# EAGLE design tiny84xbee-humi_dualProbe_v2e (EAGLE 5.10)
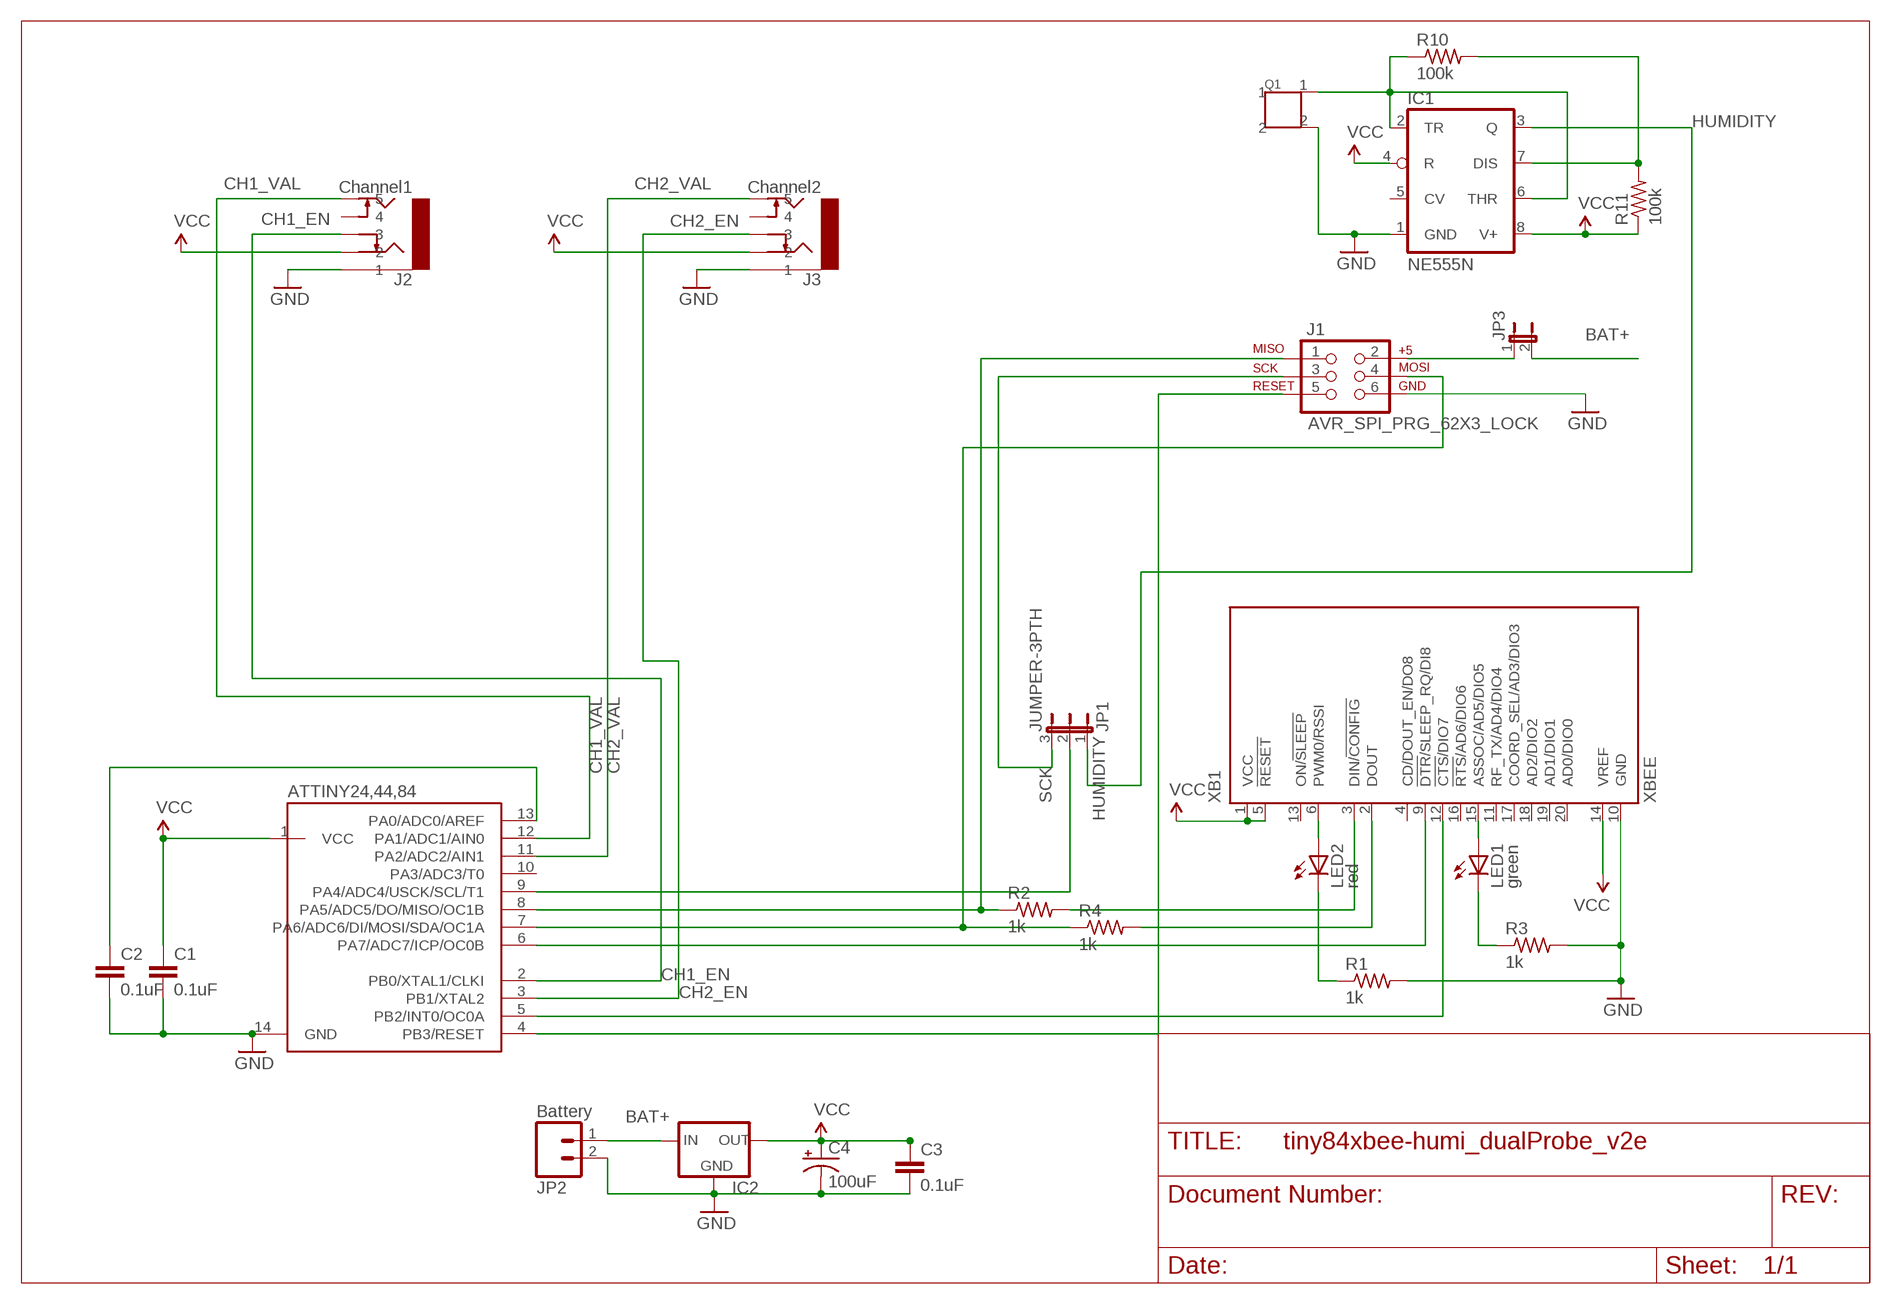
[diagram p0: schematic, sheet 1]

## Parts
ATTINY24,44,84  ATTINY24PDIP  [DIL14]
C1  0.1uF  C-EU050-025X075  [C050-025X075]
C2  0.1uF  C-EU050-035X075  [C050-035X075]
C3  0.1uF  C-EU050-035X075  [C050-035X075]
C4  100uF  CPOL-USE2-5  [E2-5]
IC1  NE555N  [DIL08-ROUND]
IC2  MCP1700INLINE  [TO92-INLINE]
J1  AVR_SPI_PRG_62X3_LOCK  [2X3_LOCK]
J2  Channel1  AUDIO-JACK-5PKYCON-STX-315X-5-X  [KYCON-STX-315X-5-XX]
J3  Channel2  AUDIO-JACK-5PKYCON-STX-315X-5-X  [KYCON-STX-315X-5-XX]
JP1  JUMPER-3PTH  [1X03]
JP2  Battery  M025MM  [SCREWTERMINAL-5MM-2]
JP3  JUMPER-2PTH  [1X02]
LED1  green  LED3MM  [LED3MM]
LED2  red  LED3MM  [LED3MM]
Q1  HCH1000  [HCH1000-001]
R1  1k  R-US_0207/10  [0207/10]
R2  1k  R-US_0207/10  [0207/10]
R3  1k  R-US_0207/10  [0207/10]
R4  1k  R-US_0207/10  [0207/10]
R10  100k  R-US_0207/10  [0207/10]
R11  100k  R-US_0207/10  [0207/10]
XB1  XBEE  [XBEE]

## Nets
BAT+: IC2.2(IN) JP2.1 JP3.2
CH1_EN: ATTINY24,44,84.2(PB0/XTAL1/CLKI) J2.P$5
CH1_VAL: ATTINY24,44,84.12(PA1/ADC1/AIN0) J2.P$4
CH2_EN: ATTINY24,44,84.3(PB1/XTAL2) J3.P$5
CH2_VAL: ATTINY24,44,84.11(PA2/ADC2/AIN1) J3.P$4
GND: ATTINY24,44,84.14(GND) C1.2 C2.2 C3.2 C4.- IC1.1(GND) IC2.1(GND) J1.6 J2.P$1 J3.P$1 JP2.2 Q1.2 R1.2 R3.2 XB1.10(GND)
HUMIDITY: IC1.3(Q) JP1.1
ICP5V: J1.2 JP3.1
MISO: ATTINY24,44,84.8(PA5/ADC5/DO/MISO/OC1B) J1.1 R2.1
MOSI: ATTINY24,44,84.7(PA6/ADC6/DI/MOSI/SDA/OC1A) J1.4 R4.1
N$1: IC1.2(TR) IC1.6(THR) Q1.1 R10.1
N$2: LED1.A XB1.15(ASSOC/AD5/DIO5)
N$3: LED1.K(C) R3.1
N$4: IC1.7(DIS) R10.2 R11.2
N$5: ATTINY24,44,84.13(PA0/ADC0/AREF) C2.1
N$6: R2.2 XB1.3(DIN/!CONFIG)
N$7: R4.2 XB1.2(DOUT)
N$8: LED2.K(C) R1.1
N$9: LED2.A XB1.6(PWM0/RSSI)
N$10: ATTINY24,44,84.5(PB2/INT0/OC0A) XB1.12(!CTS!/DIO7)
RESET: ATTINY24,44,84.4(PB3/RESET) J1.5
SCK: J1.3 JP1.3
SHARED: ATTINY24,44,84.9(PA4/ADC4/USCK/SCL/T1) JP1.2
SLEEP: ATTINY24,44,84.6(PA7/ADC7/ICP/OC0B) XB1.9(!DTR!/SLEEP_RQ/DI8)
VCC: ATTINY24,44,84.1(VCC) C1.1 C3.1 C4.+ IC1.4(R) IC1.8(V+) IC2.3(OUT) J2.P$2 J3.P$2 R11.1 XB1.1(VCC) XB1.5(!RESET) XB1.14(VREF)
Unconnected: ATTINY24,44,84.10(PA3/ADC3/T0) IC1.5(CV) J2.P$3 J3.P$3 XB1.4(CD/DOUT_EN/DO8) XB1.11(RF_TX/AD4/DIO4) XB1.13(ON/!SLEEP) XB1.16(!RTS!/AD6/DIO6) XB1.17(COORD_SEL/AD3/DIO3) XB1.18(AD2/DIO2) XB1.19(AD1/DIO1) XB1.20(AD0/DIO0)

## Library data of the parts
ATTINY24,44,84 = karlnet-parts:ATTINY24: ATtiny24/44/84. pdip and qfn packages, but the QFN package does _not_ have the bottom pad connected to ground. (doing so would make a 15 pad package, and you couldn't have PDIP and QFN in the same part)
C1-C3 = resistor:C-EU: CAPACITOR, European symbol
C4 = resistor:CPOL-US: POLARIZED CAPACITOR, American symbol
IC1 = adafruit:*555: TIMER Changed DIP package to have round (not oval) pin pads http://www.ladyada.net/library/pcb/eaglelibrary.html
IC2 = karlnet-parts:MCP1700: VOLTAGE REGULATOR
J1 = karlnet-parts:AVR_SPI_PRG_6: AVR ISP 6 Pin This is the reduced ISP connector for AVR programming. Common on Arduino. This footprint will take up less PCB space and can be used with a 10-pin to 6-pin adapter such as SKU: BOB-08508
J2 J3 = karlnet-parts:AUDIO-JACK-5P: Stereo Audio Jack, with switches for each signal contact
JP1 = SparkFun:JUMPER-3
JP2 = SparkFun:M02: Header 2 Standard 2-pin 0.1" header. Use with straight break away headers (SKU : PRT-00116), right angle break away headers (PRT-00553), swiss pins (PRT-00743), machine pins (PRT-00117), and female headers (PRT-00115). Molex polarized connector foot print use with SKU : PRT-08233 with associated crimp pins and housings.
JP3 = SparkFun:JUMPER-2: Jumper Basic 0.1" spaced jumper. Use with breakaway headers.
LED1 LED2 = adafruit:LED: LED OSRAM: - CHIPLED LG R971, LG N971, LY N971, LG Q971, LY Q971, LO R971, LY R971 LH N974, LH R974 LS Q976, LO Q976, LY Q976 LO Q996 - Hyper CHIPLED LW Q18S LB Q993, LB Q99A, LB R99A - SideLED LS A670, LO A670, LY A670, LG A670, LP A670 LB A673, LV A673, LT A673, LW A673 LH A674 LY A675 LS A676, LA A676, LO A676, LY A676, LW A676 LS A679, LY A679, LG A679 - Hyper Micro SIDELED® LS Y876, LA Y876, LO Y876, LY Y876 LT Y87S - SmartLED LW L88C, LW L88S LB L89C, LB L89S, LG L890 LS L89K, LO L89K, LY L89K LS L896, LA L896, LO L896, LY L896 - TOPLED LS T670, LO T670, LY T670, LG T670, LP T670 LSG T670, LSP T670, LSY T670, LOP T670, LYG T670 LG T671, LOG T671, LSG T671 LB T673, LV T673, LT T673, LW T673 LH T674 LS T676, LA T676, LO T676, LY T676, LB T676, LH T676, LSB T676, LW T676 LB T67C, LV T67C, LT T67C, LS T67K, LO T67K, LY T67K, LW E67C LS E67B, LA E67B, LO E67B, LY E67B, LB E67C, LV E67C, LT E67C LW T67C LS T679, LY T679, LG T679 LS T770, LO T770, LY T770, LG T770, LP T770 LB T773, LV T773, LT T773, LW T773 LH T774 LS E675, LA E675, LY E675, LS T675 LS T776, LA T776, LO T776, LY T776, LB T776 LHGB T686 LT T68C, LB T68C - Hyper Mini TOPLED® LB M676 - Mini TOPLED Santana® LG M470 LS M47K, LO M47K, LY M47K Source: http://www.osram.convergy.de/
Q1 = karlnet-parts:HCH1000: HCH1000 Capacitive Humidity Sensor Honeywell, cheap, capacitance varies with humidity
R1-R4 R10 R11 = resistor:R-US_: RESISTOR, American symbol
XB1 = microbuilder:XBEE: XBee (TM) /XBee-PRO(TM) OEM RF Modules Source: MaxStream, Inc. xbee_productmanual.pdf

## Board
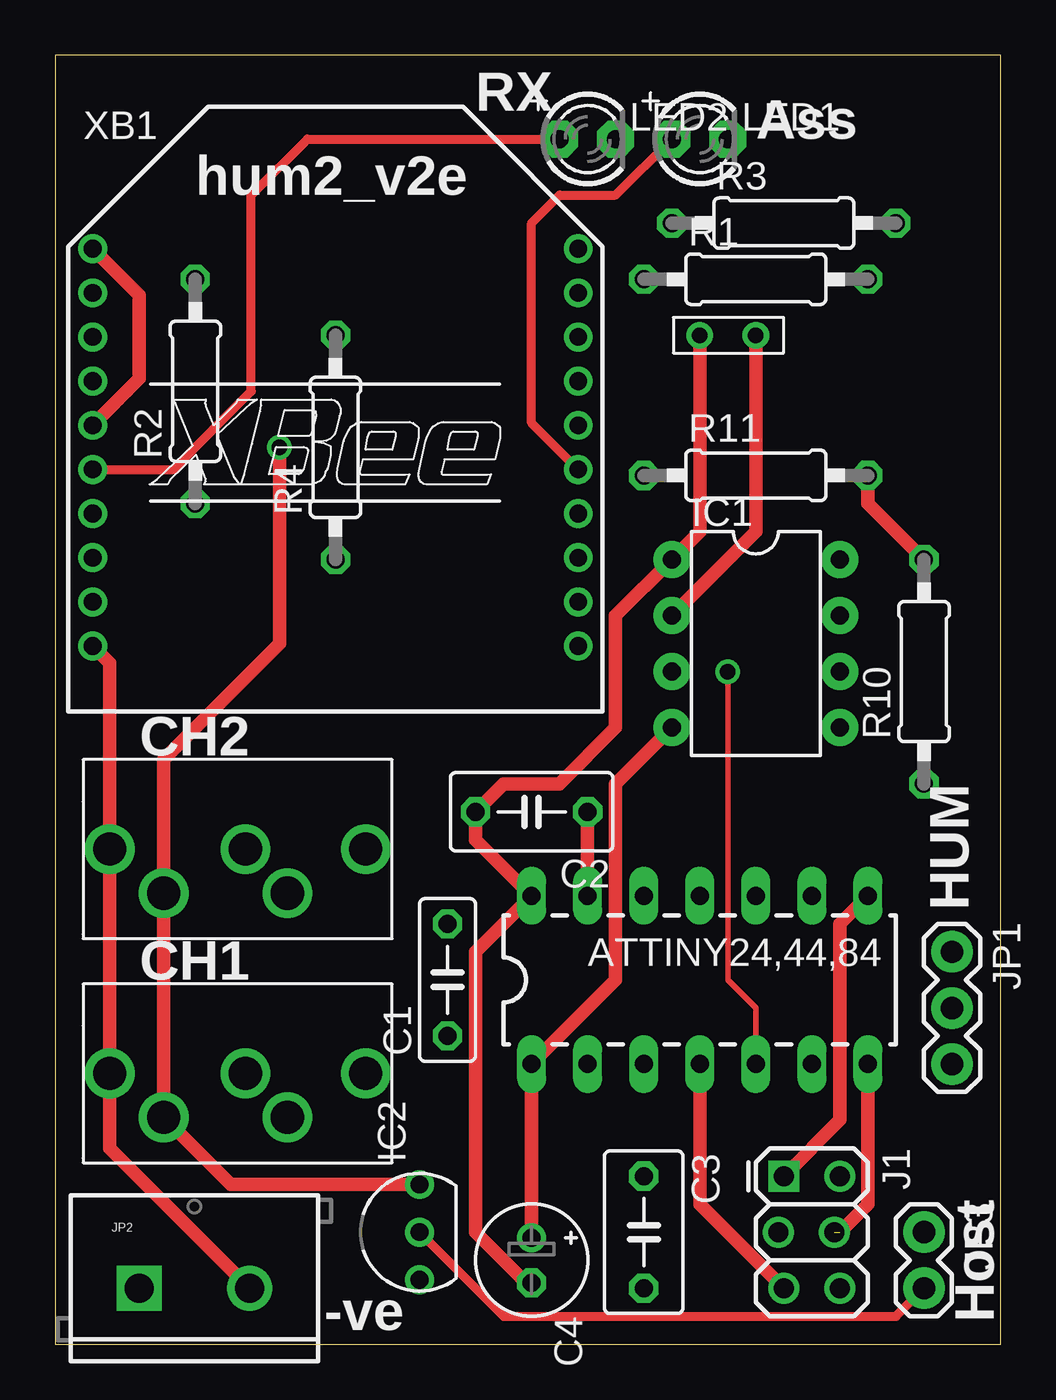
[diagram p1: board, top side]
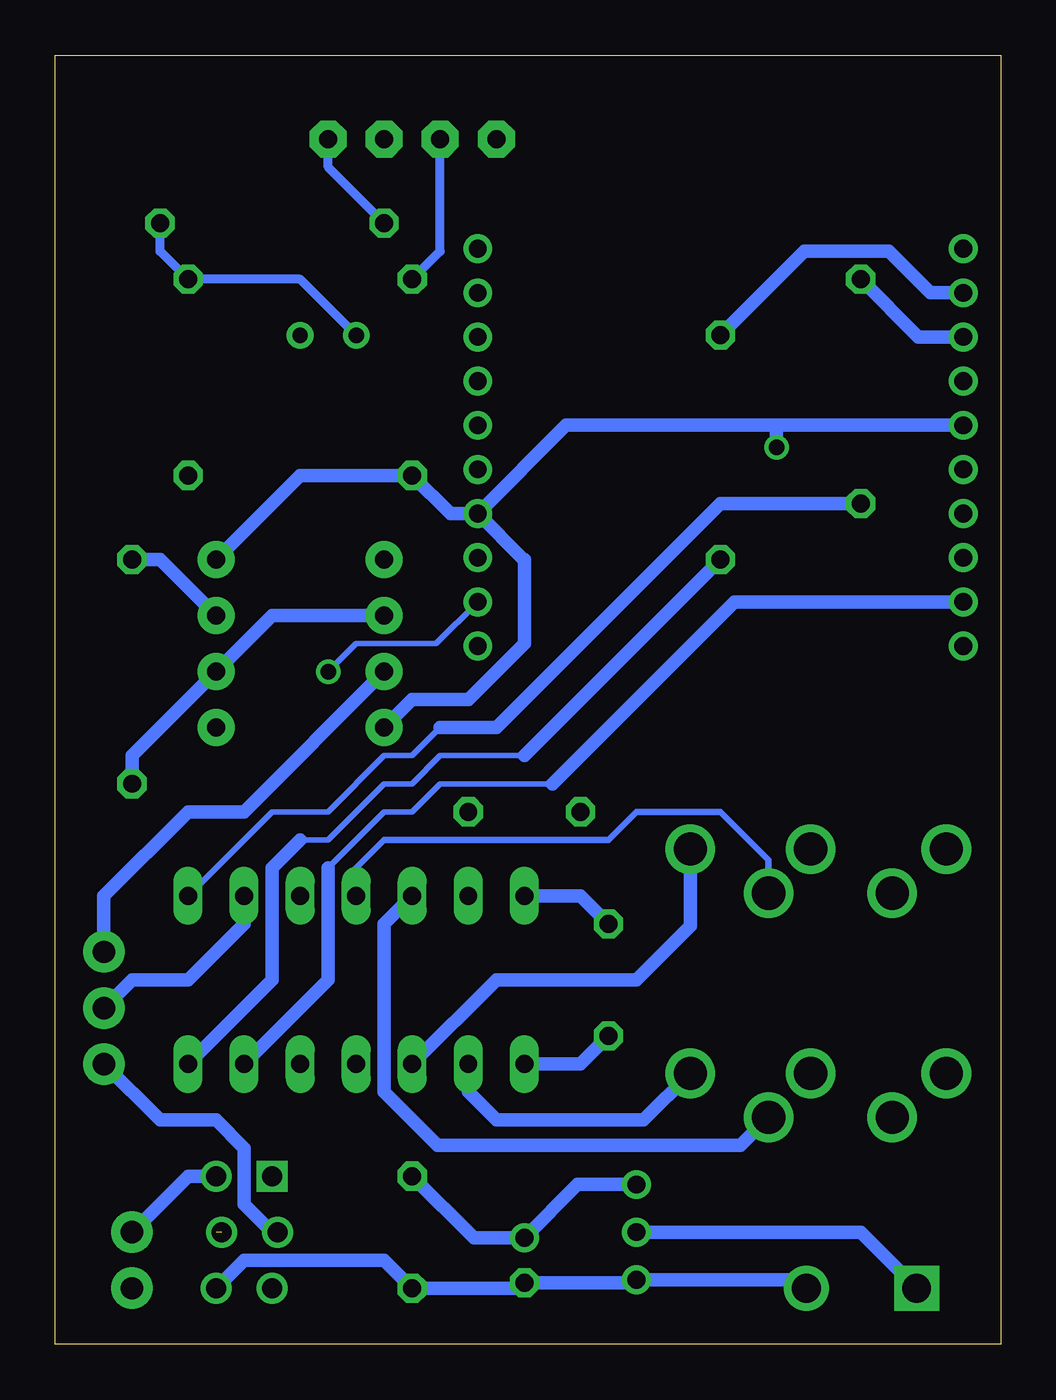
[diagram p2: board, bottom side, seen from below]

Size 42.85 x 58.41 mm. Coordinates in mm from the lower left corner, seen from the top.
Outline: 0,0 42.85,0 42.85,58.41 0,58.41 0,0
Copper layers (1*16): Top 0.035mm / dielectric 1.5mm / Bottom 0.035mm
Design rules "olimex-10mils": minimum track width 10mil, minimum drill 24mil, track to track 10mil, track to pad 10mil, pad to pad 10mil, via to via 10mil, smd to smd 10mil, copper to edge 40mil, drill to drill 10mil, minimum pad ring 10mil, minimum via ring 8mil, stop-mask expansion 0mil, vias tented up to drill 0mil, thermal gap 10mil

### Footprints (pad centres in the part's own frame; a part is rotated, then mirrored left to right if it is on the bottom)
DIL14 = drill 0.813 long: 1 -8.89,-3.81; 2 -6.35,-3.81; 3 -3.81,-3.81; 4 -1.27,-3.81; 5 1.27,-3.81; 6 3.81,-3.81; 7 6.35,-3.81; 8 6.35,3.81; 9 3.81,3.81; 10 1.27,3.81; 11 -1.27,3.81; 12 -3.81,3.81; 13 -6.35,3.81; 14 -8.89,3.81
C050-025X075 = drill 0.813 octagon: 1 -2.54,0; 2 2.54,0
C050-035X075 = drill 0.813 octagon: 1 -2.54,0; 2 2.54,0
E2-5 = drill 0.813 pad 1.27 round: + -1.016,0 | drill 0.813 pad 1.27 octagon: - 1.016,0
DIL08-ROUND = drill 0.813 pad 1.676 round: 1 -3.81,-3.81; 2 -1.27,-3.81; 3 1.27,-3.81; 4 3.81,-3.81; 5 3.81,3.81; 6 1.27,3.81; 7 -1.27,3.81; 8 -3.81,3.81
TO92-INLINE = drill 0.8 round: 1 -2.159,0; 2 0,0; 3 2.159,0
2X3_LOCK = drill 0.9 square: 1 0,0 | drill 0.9 round: 2 0,2.54; 3 2.54,-0.254; 4 2.54,2.286; 5 5.08,0; 6 5.08,2.54
KYCON-STX-315X-5-XX = drill 1.5 round: P$1 1.2,0.85; P$2 3.65,-1.15; P$3 7.35,0.85; P$4 9.25,-1.15; P$5 12.8,0.85
1X03 = drill 1.016 pad 1.88 round: 1 0,0; 2 2.54,0; 3 5.08,0
SCREWTERMINAL-5MM-2 = drill 1.3 pad 2.032 square: 1 0,0 | drill 1.3 pad 2.032 round: 2 5,0
1X02 = drill 1.016 pad 1.88 round: 1 0,0; 2 2.54,0
LED3MM = drill 0.813 pad 1.676 octagon: A -1.27,0; K 1.27,0
HCH1000-001 = drill 0.7 round: 1 -2.54,0; 2 0,0
0207/10 = drill 0.813 octagon: 1 -5.08,0; 2 5.08,0
XBEE = drill 0.8 pad 1.27 round: 1 -11,9; 2 -11,7; 3 -11,5; 4 -11,3; 5 -11,1; 6 -11,-1; 7 -11,-3; 8 -11,-5; 9 -11,-7; 10 -11,-9; 11 11,-9; 12 11,-7; 13 11,-5; 14 11,-3; 15 11,-1; 16 11,1; 17 11,3; 18 11,5; 19 11,7; 20 11,9

### Placement (x,y rotation side)
ATTINY24,44,84  30.48,16.51 0 top
C1  17.78,16.51 90 top
C2  21.59,24.13 180 top
C3  26.67,5.08 270 top
C4  21.59,3.81 270 top
IC1  31.75,31.75 270 top
IC2  16.51,5.08 90 top
J1  33.02,7.62 270 top
J2  1.27,11.43 0 top
J3  1.27,21.59 0 top
JP1  40.64,17.78 270 top
JP2  3.81,2.54 0 top
JP3  39.37,5.08 270 top
LED1  29.21,54.61 0 top
LED2  24.13,54.61 0 top
Q1  29.21,45.72 180 top
R1  31.75,48.26 0 top
R2  6.35,43.18 90 top
R3  33.02,50.8 0 top
R4  12.7,40.64 90 top
R10  39.37,30.48 90 top
R11  31.75,39.37 0 top
XB1  12.7,40.64 0 top

### Tracks (layer width: path | path; a pad name or v marks a point on that pad's centre or on a via)
BAT+
  Top 0.406: IC2.2 20.32,1.27 38.1,1.27 JP3.2
  Bottom 0.61: JP2.1 6.35,5.08 IC2.2
CH1_EN
  Bottom 0.61: ATTINY24,44,84.2 24.13,11.43 22.86,10.16 16.19,10.16 J2.P$5
CH1_VAL
  Bottom 0.61: ATTINY24,44,84.12 27.94,19.05 27.94,11.43 25.52,9.01 11.79,9.01 J2.P$4
CH2_EN
  Bottom 0.61: ATTINY24,44,84.3 22.86,16.51 16.51,16.51 14.07,18.95 J3.P$5
CH2_VAL
  Bottom 0.305: ATTINY24,44,84.11 29.21,21.59 27.94,22.86 17.78,22.86 16.51,24.13 12.7,24.13 10.52,21.95 J3.P$4
GND
  Top 0.61: JP2.2 2.47,8.88 J2.P$1 J3.P$1 2.47,30.87 XB1.10 | C4.- 21.34,2.79 19.05,5.08 19.05,17.78 ATTINY24,44,84.14 19.05,22.86 C2.2 20.32,25.4 22.86,25.4 25.4,27.94 25.4,33.02 IC1.1 29.21,36.83 Q1.2
  Bottom 0.406: R3.2 38.1,49.53 R1.2 31.75,48.26 Q1.2
  Bottom 0.61: JP2.2 9.19,2.92 IC2.1 16.64,2.79 C4.- 21.84,2.54 C3.2 27.94,3.81 34.29,3.81 J1.6 | C1.2 19.05,20.32 ATTINY24,44,84.14
HUMIDITY
  Bottom 0.61: IC1.3 34.29,24.13 36.83,24.13 40.64,20.32 JP1.1
ICP5V
  Bottom 0.61: J1.2 36.83,7.62 JP3.1
MISO
  Top 0.61: ATTINY24,44,84.8 35.56,19.05 35.56,10.16 J1.1
  Bottom 0.254: ATTINY24,44,84.8 33.02,24.13 30.48,24.13 27.94,26.67 26.67,26.67 25.4,27.94
  Bottom 0.61: 25.4,27.94 22.86,27.94 12.7,38.1 R2.1
MOSI  (1 unrouted)
  Top 0.61: ATTINY24,44,84.7 36.83,6.35 35.56,5.08
  Bottom 0.254: 31.75,22.86 30.48,22.86 27.94,25.4 26.67,25.4 25.4,26.67 21.59,26.67
  Bottom 0.61: ATTINY24,44,84.7 33.02,16.51 33.02,21.59 31.75,22.86 | 21.59,26.67 R4.1
N$1
  Top 0.61: Q1.1 31.75,36.83 IC1.2
  Bottom 0.61: R10.1 39.37,26.67 IC1.6 33.02,33.02 IC1.2
N$2
  Top 0.406: LED1.A 25.4,52.07 22.86,52.07 21.59,50.8 21.59,41.75 XB1.15
N$3
  Bottom 0.406: LED1.K 30.48,53.34 R3.1
N$4
  Top 0.61: R11.2 36.83,38.1 R10.2
  Bottom 0.61: IC1.7 38.1,35.56 R10.2
N$5
  Top 0.61: ATTINY24,44,84.13 C2.1
N$6
  Bottom 0.61: R2.2 3.73,45.64 XB1.3
N$7
  Bottom 0.61: XB1.2 3.19,47.64 5.08,49.53 8.89,49.53 R4.2
N$8
  Bottom 0.406: LED2.K 25.4,49.53 R1.1
N$9
  Top 0.406: LED2.A 11.43,54.61 8.89,52.07 8.89,43.18 5.35,39.64 XB1.6
N$10  (via drill 0.7)
  Top 0.254: ATTINY24,44,84.5 31.75,15.24 30.48,16.51 v30.48,30.48
  Bottom 0.254: XB1.12 25.59,31.75 29.21,31.75 v30.48,30.48
RESET
  Top 0.61: ATTINY24,44,84.4 29.21,6.35 J1.5
SCK
  Bottom 0.61: J1.3 33.02,5.08 34.29,6.35 34.29,8.89 35.56,10.16 38.1,10.16 JP1.3
SHARED
  Bottom 0.61: JP1.2 39.37,16.51 36.83,16.51 34.29,19.05 ATTINY24,44,84.9
SLEEP
  Bottom 0.254: 30.48,21.59 27.94,24.13 26.67,24.13 25.4,25.4 20.32,25.4
  Bottom 0.61: ATTINY24,44,84.6 30.48,16.51 30.48,21.59 | 20.32,25.4 12.08,33.64 XB1.9
VCC  (via drill 0.7)
  Top 0.61: XB1.1 3.81,47.53 3.81,43.75 XB1.5 | IC1.4 25.4,25.4 25.4,16.51 ATTINY24,44,84.1 21.59,5.08 | IC2.3 7.96,7.24 J2.P$2 J3.P$2 4.92,26.51 10.16,31.75 v10.16,40.64
  Bottom 0.61: C3.1 23.88,4.83 C4.+ 19.18,7.24 IC2.3 | C1.1 19.05,12.7 ATTINY24,44,84.1 | IC1.8 31.75,39.37 R11.1 24.94,37.64 XB1.14 | XB1.14 19.7,41.64 10.16,41.64 | 10.16,41.64 XB1.5 | v10.16,40.64 10.16,41.64 | XB1.14 21.62,35.56 21.59,35.56 21.59,31.75 24.13,29.21 26.67,29.21 IC1.4

### Text on the board
tPlace: RX | Ass | hum2_v2e | CH2 | HUM | CH1 | -ve | Host